# EAGLE design Transponder (EAGLE 9.5.2)
CNAME: Lesley Wheat; VERSION: v1.2
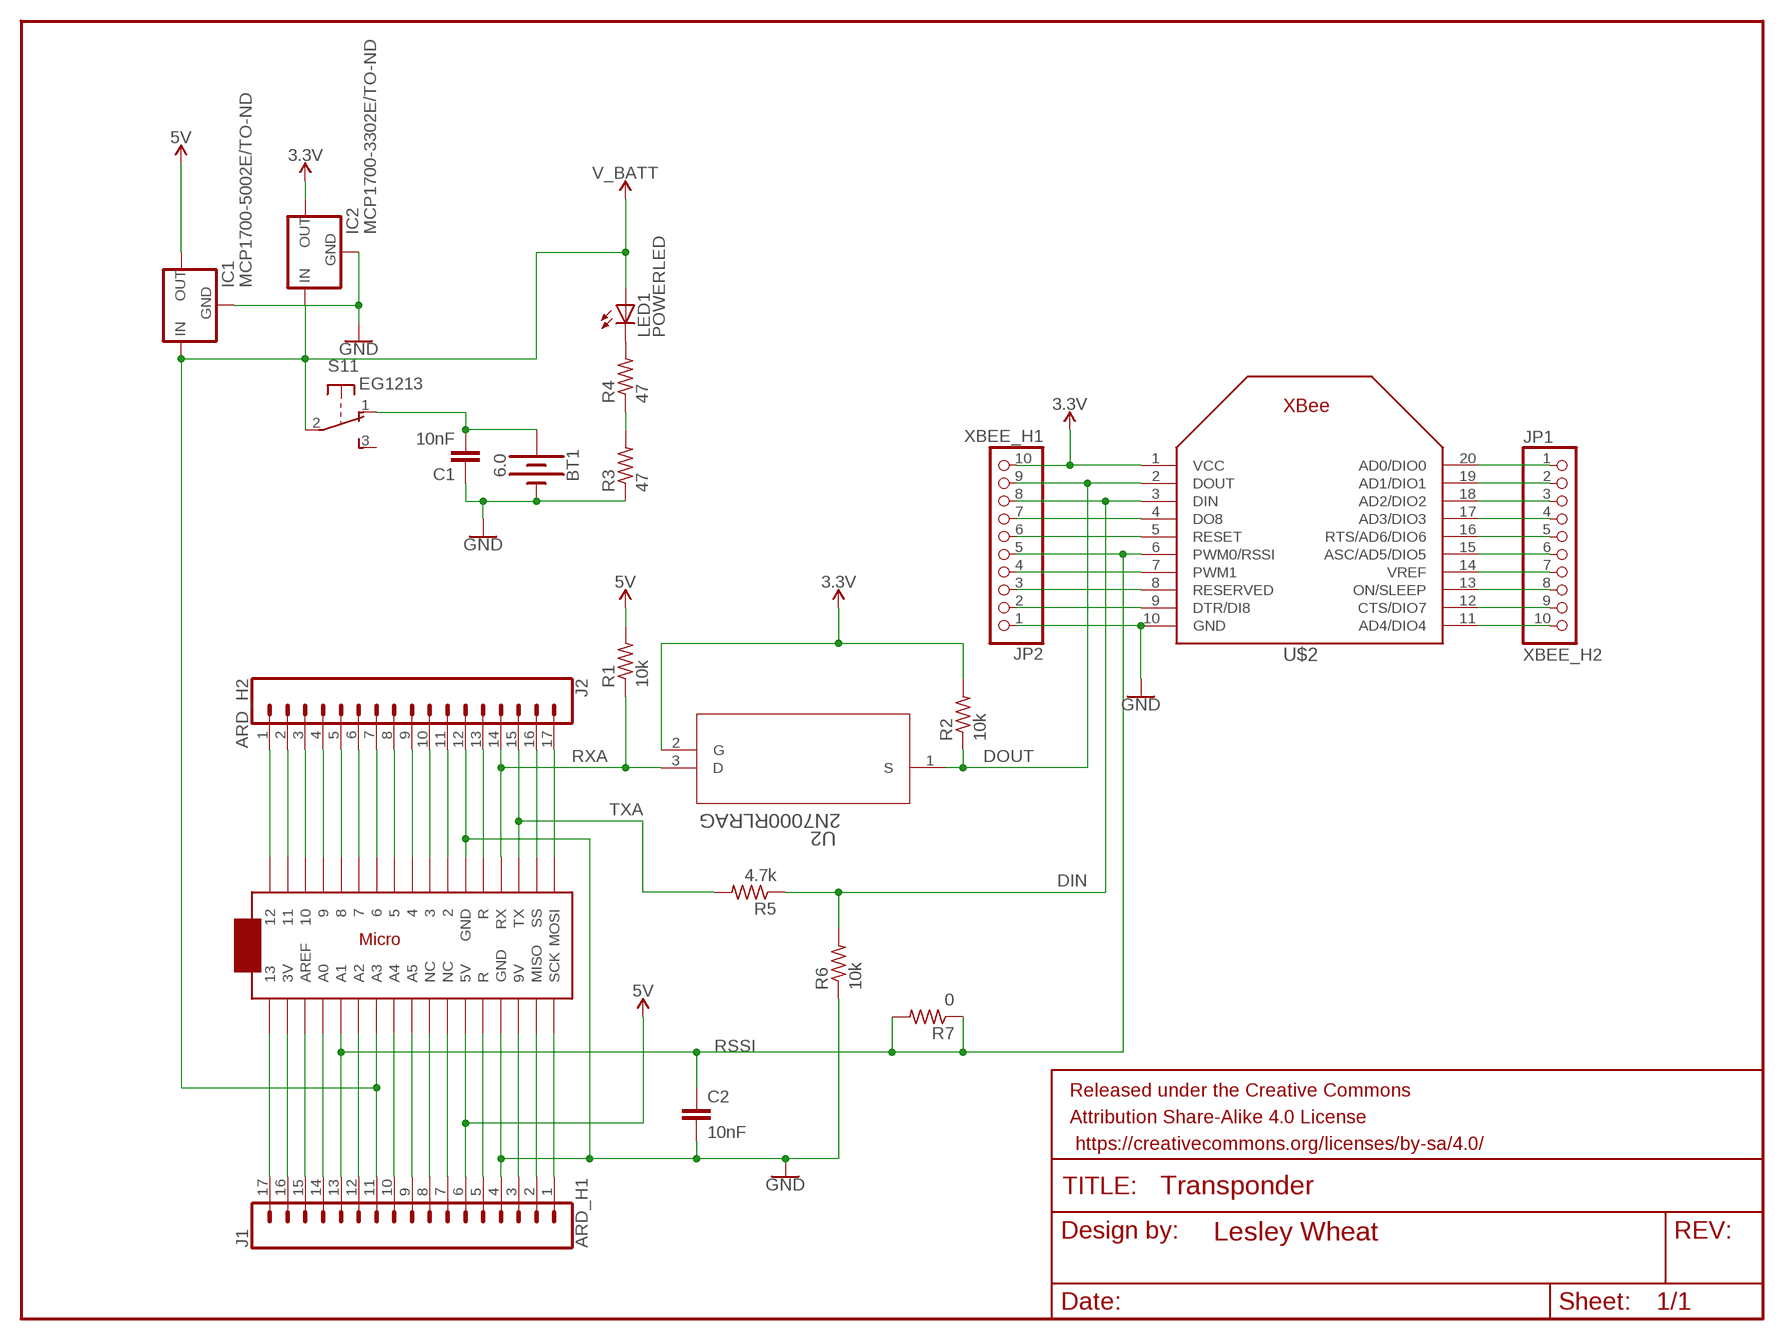
[diagram p0: schematic, sheet 1]

## Parts
BT1  6.0  BATTERY-20MM_SMD_4LEGS  [BATTCON_20MM_4LEGS]
C1  10nF  10NF-PTH-10MM-10000V-1-%  [CAP-PTH-10MM]
C2  10nF  10NF-PTH-10MM-10000V-1-%  [CAP-PTH-10MM]
FRAME1  FRAME-LETTERNO_PACKAGE  [DUMMY]
IC1  MCP1700-5002E/TO-ND  MCP1700INLINE  [TO92-INLINE]
IC2  MCP1700-3302E/TO-ND  MCP1700INLINE  [TO92-INLINE]
J1  ARD_H1  CONN_17NOSILK  [1X17_NO_SILK]
J2  ARD_H2  CONN_17NOSILK  [1X17_NO_SILK]
JP1  XBEE_H2  PINHD-1X10_2.00  [1X10M]
JP2  XBEE_H1  PINHD-1X10_2.00  [1X10M]
LED1  POWERLED  LED5MM  [LED5MM]
R1  10k  R-US_0207/12  [0207/12]
R2  10k  R-US_0207/12  [0207/12]
R3  47  R-US_0207/12  [0207/12]
R4  47  R-US_0207/12  [0207/12]
R5  4.7k  R-US_0207/12  [0207/12]
R6  10k  R-US_0207/12  [0207/12]
R7  0  R-US_0207/12  [0207/12]
S1  EG1213  [EG1213]
U2  2N7000RLRAG  [TO-92]
U$1  ARDUINOMICRO  [ARDUINOMICRO]
U$2  XBEE  [XBEE]

## Nets
3.3V: IC2.3(OUT) JP2.10 R2.2 U2.2(G) U$2.1(VCC)
5V: IC1.3(OUT) J1.6 R1.2 U$1.P$23(5V)
DIN: JP2.8 R5.1 R6.2 U$2.3(DIN)
DOUT: JP2.9 R2.1 U2.1(S) U$2.2(DOUT)
GND: BT1.NEGATIVE(-) C1.1 C2.2 IC1.1(GND) IC2.1(GND) J1.4 J2.12 JP2.1 R3.1 R6.1 U$1.P$12(GND) U$1.P$21(GND) U$2.10(GND)
N$1: BT1.POSITIVE@1(+) BT1.POSITIVE@2(+) BT1.POSITIVE@3(+) BT1.POSITIVE@4(+) C1.2 S1.1(1:O)
N$2: JP2.3 U$2.8(RESERVED)
N$3: J1.14 U$1.P$31(A0)
N$4: LED1.K(C) R4.2
N$5: R3.2 R4.1
N$6: J1.17 U$1.P$34
N$7: J1.15 U$1.P$32(AREF)
N$9: J1.12 U$1.P$29(A2)
N$11: J1.9 U$1.P$26(A5)
N$12: J1.10 U$1.P$27(A4)
N$13: J1.8 U$1.P$25(NC)
N$14: J1.7 U$1.P$24(NC)
N$15: J1.5 U$1.P$13(R)
N$16: J1.3 U$1.P$20(9V)
N$17: J1.2 U$1.P$19(MISO)
N$18: J1.1 U$1.P$18(SCK)
N$19: J2.17 U$1.P$17(MOSI)
N$20: J2.16 U$1.P$16(SS)
N$21: J2.13 U$1.P$22(R)
N$23: J2.11 U$1.P$11
N$24: J2.10 U$1.P$10
N$25: J2.9 U$1.P$9
N$26: J2.7 U$1.P$7
N$28: J2.8 U$1.P$8
N$29: JP1.1 U$2.20(AD0/DIO0)
N$30: J2.6 U$1.P$6
N$31: J2.5 U$1.P$5
N$32: J2.4 U$1.P$4
N$33: J2.3 U$1.P$3
N$34: J2.2 U$1.P$2
N$35: J2.1 U$1.P$1
N$36: J1.16 U$1.P$33(3V)
N$37: JP1.2 U$2.19(AD1/DIO1)
N$38: JP1.3 U$2.18(AD2/DIO2)
N$39: JP1.4 U$2.17(AD3/DIO3)
N$40: JP1.5 U$2.16(RTS/AD6/DIO6)
N$41: JP1.6 U$2.15(ASC/AD5/DIO5)
N$42: JP1.7 U$2.14(VREF)
N$43: JP1.8 U$2.13(ON/SLEEP)
N$44: JP1.9 U$2.12(CTS/DIO7)
N$45: JP1.10 U$2.11(AD4/DIO4)
N$46: JP2.2 U$2.9(DTR/DI8)
N$47: JP2.4 U$2.7(PWM1)
N$49: JP2.6 U$2.5(RESET)
N$50: JP2.7 U$2.4(DO8)
RSSI: C2.1 J1.13 JP2.5 R7.1 R7.2 U$1.P$30(A1) U$2.6(PWM0/RSSI)
RXA: J2.14 R1.1 U2.3(D) U$1.P$14(RX)
TXA: J2.15 R5.2 U$1.P$15(TX)
V_BATT: IC1.2(IN) IC2.2(IN) J1.11 LED1.A S1.2(1:P) U$1.P$28(A3)
Unconnected: S1.3(1:S) S1.MT1(MT) S1.MT2(MT)

## Library data of the parts
BT1 = SparkFun-Batteries:BATTERY: Battery - Single Cell A variety of battery chemistries, sizes, and footprints. Device List: 20MM_PTH - Coin Cell Battery Holder - 20mm (PTH) <https://www.sparkfun.com/products/783> 20MM_PTH_KIT- Coin Cell battery Holder - 20 mm (PTH) <http://www.sparkfun.com/products/783>kit version with special mask 6.8MM_PTH - Coin Cell Battery Holder - 6.8MM(SMD) <https://www.digikey.com/product-detail/en/seiko-instruments/MS621FE-FL11E/728-1057-ND/1889208?WT.srch=1&gclid=CNOQ5a6LzdQCFZS2wAodXCkE0g> 12MM_SMD - Coin Cell Battery Holder - 12mm (SMD) <https://www.sparkfun.com/products/10592> 12MM_PTH - Coin Cell Battery Holder - 12mm (PTH) <https://www.sparkfun.com/products/7948> 20MM_SMD - 20mm Coin Cell Battery Holder (SMD) (2 legs) Used on the Big Time Watch Kit <https://www.sparkfun.com/products/11734> 20MM_SMD_4LEGS - Coin Cell Battery Holder - 20mm (SMD) <https://www.sparkfun.com/products/11892> 20MM_SMD_4LEGS_OVERPASTE - Coin Cell Battery Holder - 20mm (SMD) <https://www.sparkfun.com/products/11892> (Over-paste on the legs) 24.5MM_PTH - Coin Cell Battery Holder - 24.5mm (PTH) <https://www.sparkfun.com/products/8863> 9V - 9V Battery Holder - PC Mount Used on the SparkFun SparkPunk Sound Kit <https://www.sparkfun.com/products/11177> and SparkFun SparkPunk Sequencer Kit <https://www.sparkfun.com/products/12707> 18650 - Battery Holder - 18650 (PTH) <https://www.sparkfun.com/products/13113> AA - Battery Holder - 1xAA (PTH) <https://www.sparkfun.com/products/7949> AAA - Battery Holder - 1xAAA (PTH) <https://www.sparkfun.com/products/12718> AA_KIT - Battery Holder - 1xAA (PTH) <https://www.sparkfun.com/products/7949> Special kit package - pads only have exposed copper on one side of the board. AAA_KIT - Battery Holder - 1xAAA (PTH) <https://www.sparkfun.com/products/12718> Special kit package - pads only have exposed copper on one side of the board.; PROD_ID: BATT-10373; SF_SKU: PRT-11892
C1 C2 = SparkFun-Capacitors:10NF: 0.01uF/10nF/10,000pF ceramic capacitors A capacitor is a passive two-terminal electrical component used to store electrical energy temporarily in an electric field. CAP-09321; PROD_ID: CAP-09321
FRAME1 = SparkFun-Aesthetics:FRAME-LETTER: Schematic Frame - Letter Standard 8.5x11 US Letter frame; DESIGNER: Lesley Wheat; VERSION: v01
IC1 IC2 = adafruit:MCP1700: VOLTAGE REGULATOR
J1 J2 = SparkFun-Connectors:CONN_17: Multi connection point. Often used as Generic Header-pin footprint for 0.1 inch spaced/style header connections On any of the 0.1 inch spaced packages, you can populate with these: Break Away Headers - Straight <https://www.sparkfun.com/products/116> (PRT-00116) Break Away Male Headers - Right Angle <https://www.sparkfun.com/products/553> (PRT-00553) Female Headers <https://www.sparkfun.com/products/115> (PRT-00115) Break Away Headers - Machine Pin <https://www.sparkfun.com/products/117> (PRT-00117) Break Away Female Headers - Swiss Machine Pin <https://www.sparkfun.com/products/743> (PRT-00743) For SCREWTERMINALS and SPRING TERMINALS visit here: Screw Terimnals on SparkFun.com <https://www.sparkfun.com/search/results?term=Screw+Terminals> (5mm/3.5mm/2.54mm spacing) This device is also useful as a general connection point to wire up your design to another part of your project. Our various solder wires solder well into these plated through hole pads. Hook-Up Wire - Assortment (Stranded, 22 AWG) <https://www.sparkfun.com/products/11375> (PRT-11375) Hook-Up Wire - Assortment (Solid Core, 22 AWG) <https://www.sparkfun.com/products/11367> (PRT-11367) View the entire wire category on our website here <https://www.sparkfun.com/categories/141> Special notes: Molex polarized connector foot print use with SKU : PRT-08231 with associated crimp pins and housings. 1MM SMD Version SKU: PRT-10208 NOTES ON THE VARIANTS LOCK and LOCK_LONGPADS... This footprint was designed to help hold the alignment of a through-hole component (i.e. 6-pin header) while soldering it into place. You may notice that each hole has been shifted either up or down by 0.005 of an inch from it's more standard position (which is a perfectly straight line). This slight alteration caused the pins (the squares in the middle) to touch the edges of the holes. Because they are alternating, it causes a "brace" to hold the component in place. 0.005 has proven to be the perfect amount of "off-center" position when using our standard breakaway headers. Although looks a little odd when you look at the bare footprint, once you have a header in there, the alteration is very hard to notice. Also,if you push a header all the way into place, it is covered up entirely on the bottom side.
JP1 JP2 = pinhead-2:PINHD-1X10: PIN HEADER
LED1 = led:LED: LED OSRAM: - CHIPLED LG R971, LG N971, LY N971, LG Q971, LY Q971, LO R971, LY R971 LH N974, LH R974 LS Q976, LO Q976, LY Q976 LO Q996 - Hyper CHIPLED LW Q18S LB Q993, LB Q99A, LB R99A - SideLED LS A670, LO A670, LY A670, LG A670, LP A670 LB A673, LV A673, LT A673, LW A673 LH A674 LY A675 LS A676, LA A676, LO A676, LY A676, LW A676 LS A679, LY A679, LG A679 - Hyper Micro SIDELED® LS Y876, LA Y876, LO Y876, LY Y876 LT Y87S - SmartLED LW L88C, LW L88S LB L89C, LB L89S, LG L890 LS L89K, LO L89K, LY L89K LS L896, LA L896, LO L896, LY L896 - TOPLED LS T670, LO T670, LY T670, LG T670, LP T670 LSG T670, LSP T670, LSY T670, LOP T670, LYG T670 LG T671, LOG T671, LSG T671 LB T673, LV T673, LT T673, LW T673 LH T674 LS T676, LA T676, LO T676, LY T676, LB T676, LH T676, LSB T676, LW T676 LB T67C, LV T67C, LT T67C, LS T67K, LO T67K, LY T67K, LW E67C LS E67B, LA E67B, LO E67B, LY E67B, LB E67C, LV E67C, LT E67C LW T67C LS T679, LY T679, LG T679 LS T770, LO T770, LY T770, LG T770, LP T770 LB T773, LV T773, LT T773, LW T773 LH T774 LS E675, LA E675, LY E675, LS T675 LS T776, LA T776, LO T776, LY T776, LB T776 LHGB T686 LT T68C, LB T68C - Hyper Mini TOPLED® LB M676 - Mini TOPLED Santana® LG M470 LS M47K, LO M47K, LY M47K Source: http://www.osram.convergy.de LUXEON: - LUMILED® LXK2-PW12-R00, LXK2-PW12-S00, LXK2-PW14-U00, LXK2-PW14-V00 LXK2-PM12-R00, LXK2-PM12-S00, LXK2-PM14-U00 LXK2-PE12-Q00, LXK2-PE12-R00, LXK2-PE12-S00, LXK2-PE14-T00, LXK2-PE14-U00 LXK2-PB12-K00, LXK2-PB12-L00, LXK2-PB12-M00, LXK2-PB14-N00, LXK2-PB14-P00, LXK2-PB14-Q00 LXK2-PR12-L00, LXK2-PR12-M00, LXK2-PR14-Q00, LXK2-PR14-R00 LXK2-PD12-Q00, LXK2-PD12-R00, LXK2-PD12-S00 LXK2-PH12-R00, LXK2-PH12-S00 LXK2-PL12-P00, LXK2-PL12-Q00, LXK2-PL12-R00 Source: www.luxeon.com KINGBRIGHT: KA-3528ASYC Source: www.kingbright.com
R1-R7 = resistor:R-US_: RESISTOR, American symbol
S1 = adafruit:EG1213: E-Switch right-angle slide SPDT Part #EG1213 http://www.ladyada.net/library/eagle
U2 = 2N7000RLRAG:2N7000RLRAG; BUILT_BY: EMA_UL_Team; MANUFACTURER_PART_NUMBER: 2N7000RLRAG; VENDOR: ON Semiconductor
U$1 = adafruit:ARDUINOMICRO
U$2 = adafruit:XBEE

## Net classes
0 default: clearance 0.205 mm

## Board
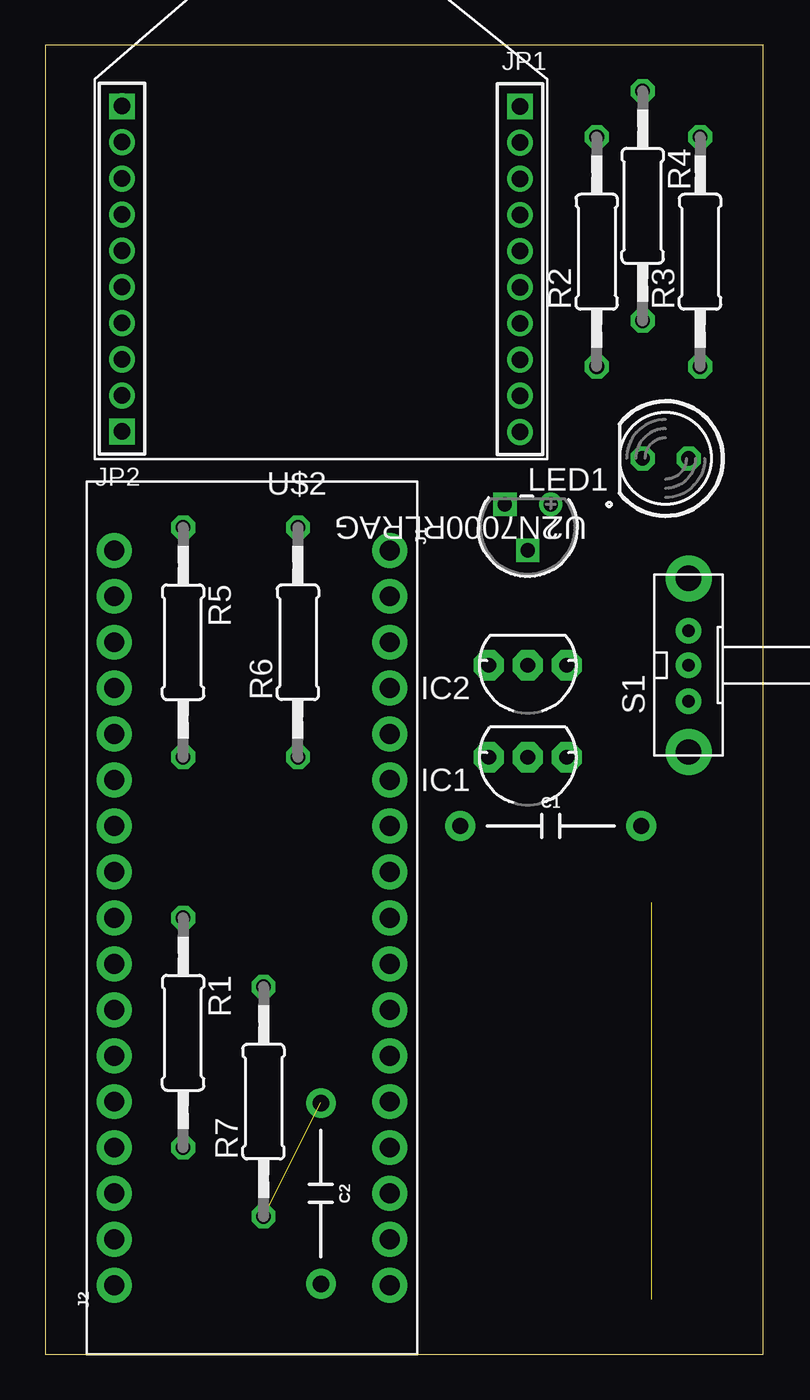
[diagram p1: board, top side]
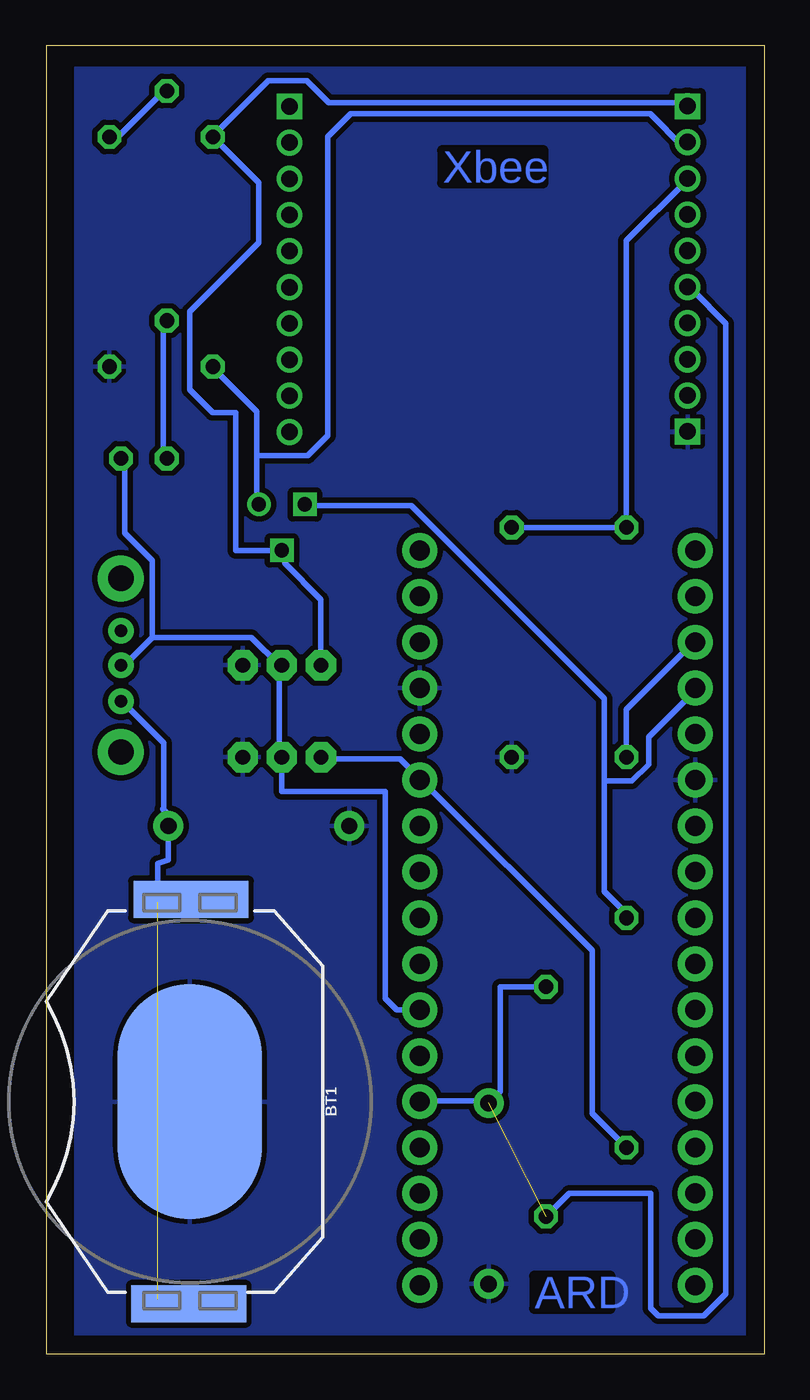
[diagram p2: board, bottom side, seen from below]

Size 39.67 x 72.38 mm. Coordinates in mm from the lower left corner, seen from the top.
Outline: 0,0 39.67,0 39.67,72.38 0,72.38 0,0
Copper layers (1*16): Top 0.035mm / dielectric 1.5mm / Bottom 0.035mm
Design rules "default *": minimum track width 12mil, minimum drill 20mil, track to track 12mil, track to pad 12mil, pad to pad 12mil, via to via 12mil, smd to smd 12mil, copper to edge 40mil, drill to drill 12mil, minimum pad ring 10mil, minimum via ring 8mil, stop-mask expansion 4mil, vias tented up to drill 0mil, thermal gap 10mil

### Footprints (pad centres in the part's own frame; a part is rotated, then mirrored left to right if it is on the bottom)
BATTCON_20MM_4LEGS = smd 13 x 8: NEGATIVE 0,0 | smd 2.032 x 3.175: POSITIVE@1 -11.176,1.651; POSITIVE@2 -11.176,-1.524; POSITIVE@3 11.176,1.524; POSITIVE@4 11.176,-1.651
CAP-PTH-10MM = drill 0.9 pad 1.651: 1 -5,0; 2 5,0
TO92-INLINE = drill 0.813 pad 1.676 octagon: 1 -2.159,0; 2 0,0; 3 2.159,0
1X17_NO_SILK = drill 1.016 pad 1.88: 1 0,0; 2 2.54,0; 3 5.08,0; 4 7.62,0; 5 10.16,0; 6 12.7,0; 7 15.24,0; 8 17.78,0; 9 20.32,0; 10 22.86,0; 11 25.4,0; 12 27.94,0; 13 30.48,0; 14 33.02,0; 15 35.56,0; 16 38.1,0; 17 40.64,0
1X10M = drill 0.914 square: 1 -9,0 | drill 0.914: 2 -7,0; 3 -5,0; 4 -3,0; 5 -1,0; 6 1,0; 7 3,0; 8 5,0; 9 7,0; 10 9,0
LED5MM = drill 0.813 octagon: A -1.27,0; K 1.27,0
0207/12 = drill 0.813 octagon: 1 -6.35,0; 2 6.35,0
EG1213 = drill 0.7 pad 1.422: 1 -2,0; 2 0,0; 3 1.9,0 | drill 1.4 pad 2.54: MT1 -4.8,0; MT2 4.8,0
TO-92 = drill 0.787 pad 1.295: 1 -2.54,-2.54 | drill 0.787 pad 1.295 square: 2 -1.27,0; 3 0,-2.54
ARDUINOMICRO = drill 1.1 pad 1.93: P$1 -20.32,7.62; P$2 -17.78,7.62; P$3 -15.24,7.62; P$4 -12.7,7.62; P$5 -10.16,7.62; P$6 -7.62,7.62; P$7 -5.08,7.62; P$8 -2.54,7.62; P$9 0,7.62; P$10 2.54,7.62; P$11 5.08,7.62; P$12 12.7,-7.62; P$13 10.16,-7.62; P$14 12.7,7.62; P$15 15.24,7.62; P$16 17.78,7.62; P$17 20.32,7.62; P$18 20.32,-7.62; P$19 17.78,-7.62; P$20 15.24,-7.62; P$21 7.62,7.62; P$22 10.16,7.62; P$23 7.62,-7.62; P$24 5.08,-7.62; P$25 2.54,-7.62; P$26 0,-7.62; P$27 -2.54,-7.62; P$28 -5.08,-7.62; P$29 -7.62,-7.62; P$30 -10.16,-7.62; P$31 -12.7,-7.62; P$32 -15.24,-7.62; P$33 -17.78,-7.62; P$34 -20.32,-7.62
XBEE = drill 0.7 pad 1.422 square: 1 -11,5.5 | drill 0.7 pad 1.422: 2 -11,3.5; 3 -11,1.5; 4 -11,-0.5; 5 -11,-2.5; 6 -11,-4.5; 7 -11,-6.5; 8 -11,-8.5; 9 -11,-10.5; 10 -11,-12.5; 11 11,-12.5; 12 11,-10.5; 13 11,-8.5; 14 11,-6.5; 15 11,-4.5; 16 11,-2.5; 17 11,-0.5; 18 11,1.5; 19 11,3.5; 20 11,5.5

### Placement (x,y rotation side)
BT1  31.75,13.97 270 bottom
C1  27.94,29.21 0 top
C2  15.24,8.89 270 top
FRAME1  -69.85,85.09 0 top  (outside the outline)
IC1  26.67,33.02 180 top
IC2  26.67,38.1 180 top
J1  19.05,44.45 270 top
J2  3.81,3.81 90 top
JP1  26.24,59.99 270 top
JP2  4.24,60.02 90 top
LED1  34.29,49.53 180 top
R1  7.62,17.78 270 top
R2  30.48,60.96 90 top
R3  36.2,60.96 90 top
R4  33.02,63.5 270 top
R5  7.62,39.37 270 top
R6  13.97,39.37 90 top
R7  12.06,13.97 90 top
S1  35.56,38.1 90 top
U2  25.4,44.45 180 top
U$1  11.43,24.13 90 top
U$2  15.24,63.5 0 top

### Tracks (layer width: path | path; a pad name or v marks a point on that pad's centre or on a via)
3.3V
  Bottom 0.305: 4.27,69.19 JP2.10 | IC2.3 24.51,41.73 26.52,43.74 26.52,44.2 U2.2 | 26.82,44.2 U2.2 | 4.27,69.19 24.08,69.19 25.3,70.41 27.43,70.41 30.48,67.36 R2.2 27.94,64.77 27.94,61.47 31.75,57.66 31.75,53.34 30.48,52.07 29.21,52.07 29.21,44.45 U2.2 | 4.27,69.19 U$2.1
5V
  Bottom 0.305: R1.2 9.53,13.34 9.53,22.33 18.9,31.7 J1.6 | IC1.3 24.38,32.92 20.12,32.92 19.2,32 J1.6 | 19.2,31.7 J1.6
DIN
  Bottom 0.305: JP2.8 4.27,65.23 U$2.3 4.27,64.92 7.62,61.57 R5.1 R6.2
DOUT
  Bottom 0.305: JP2.9 4.27,67.06 U$2.2 4.49,66.75 6.32,68.58 22.86,68.58 24.13,67.31 24.13,50.8 25.25,49.68 28.04,49.68 | 28.04,49.68 28.04,52.12 30.48,54.56 R2.1 | 28.04,49.68 28.04,47.24 U2.1
GND
  pour Bottom: 0,0 0,71.12 38.1,71.12 38.1,0
N$1  (1 unrouted)
  Bottom 0.305: BT1.POSITIVE@3 30.48,2.74 33.22,2.74 BT1.POSITIVE@4 33.53,3.05 | BT1.POSITIVE@1 30.18,25.3 33.22,25.3 BT1.POSITIVE@2 | S1.1 35.36,35.97 33.2,33.81 33.2,30.25 33.26,30.16 32.94,29.84 C1.2 32.94,27.34 33.53,27.13 33.53,25.3 BT1.POSITIVE@2 | 33.53,24.99 BT1.POSITIVE@2
N$2
  Bottom 0.305: U$2.8 4.27,55.17 JP2.3
N$4
  Bottom 0.305: LED1.K 33.22,49.68 33.22,57 R4.2
N$5
  Bottom 0.305: R4.1 33.22,69.8 36.03,66.99 R3.2
N$29
  Bottom 0.305: U$2.20 26.21,69.19 U$2.20
N$37
  Bottom 0.305: U$2.19 26.21,67.06 U$2.19
N$38
  Bottom 0.305: U$2.18 26.21,65.23 U$2.18
N$39
  Bottom 0.305: JP1.4 26.21,63.09 U$2.17
N$40
  Bottom 0.305: JP1.5 26.21,60.96 U$2.16
N$41
  Bottom 0.305: JP1.6 26.21,59.13 U$2.15
N$42
  Bottom 0.305: JP1.7 26.21,57 U$2.14
N$43
  Bottom 0.305: JP1.8 26.21,55.17 U$2.13
N$44
  Bottom 0.305: JP1.9 26.21,53.03 U$2.12
N$45
  Bottom 0.305: JP1.10 26.21,51.21 U$2.11
N$46
  Bottom 0.305: U$2.9 4.27,53.03 JP2.2
N$47
  Bottom 0.305: U$2.7 4.27,57 JP2.4
N$49
  Bottom 0.305: U$2.5 4.27,60.96 JP2.6
N$50
  Bottom 0.305: U$2.4 4.27,63.09 JP2.7
RSSI  (1 unrouted)
  Bottom 0.305: 19.2,14.02 U$1.P$30 18.9,14.02 15.24,14.02 C2.1 14.61,14.53 14.61,20.32 R7.2 | JP2.5 4.27,59.13 U$2.6 3.96,58.83 2.13,57 2.13,3.35 3.35,2.13 5.87,2.13 6.28,2.54 6.28,8.89 10.79,8.89 R7.1
RXA
  Bottom 0.305: 3.96,36.88 J2.14 3.96,36.58 6.4,34.14 6.4,32.61 7.32,31.7 8.84,31.7 | 8.84,31.7 8.84,25.6 7.62,24.38 R1.1 | 8.84,31.7 8.84,36.27 19.51,46.94 25.3,46.94 U2.3
TXA
  Bottom 0.305: R5.2 7.62,35.66 3.96,39.32 J2.15
V_BATT
  Bottom 0.305: 33.83,39.62 33.83,43.89 35.36,45.41 35.36,49.38 LED1.A | 33.83,39.62 35.36,38.1 S1.2 | 26.82,38.1 26.82,33.22 IC1.2 | 26.52,32.92 IC1.2 | 33.83,39.62 28.35,39.62 26.82,38.1 | 26.82,38.1 IC2.2 | IC1.2 26.67,31.11 20.95,31.11 20.95,19.68 20.32,19.05 U$1.P$28

### Text on the board
Bottom: Xbee | ARD